# EasyEDA Pro project LCEDA_ProProject_2024-03-29.epro

# Schematic Schematic1
Create Date: 2024-03-13; Page Name: P1; Project Name: 为台式机设计的USB重力6D传感器; Schematic Name: Schematic1; Update Date: 2024-03-14; Company: Lzyor Studio; Page Size: A4; Version: V1.0
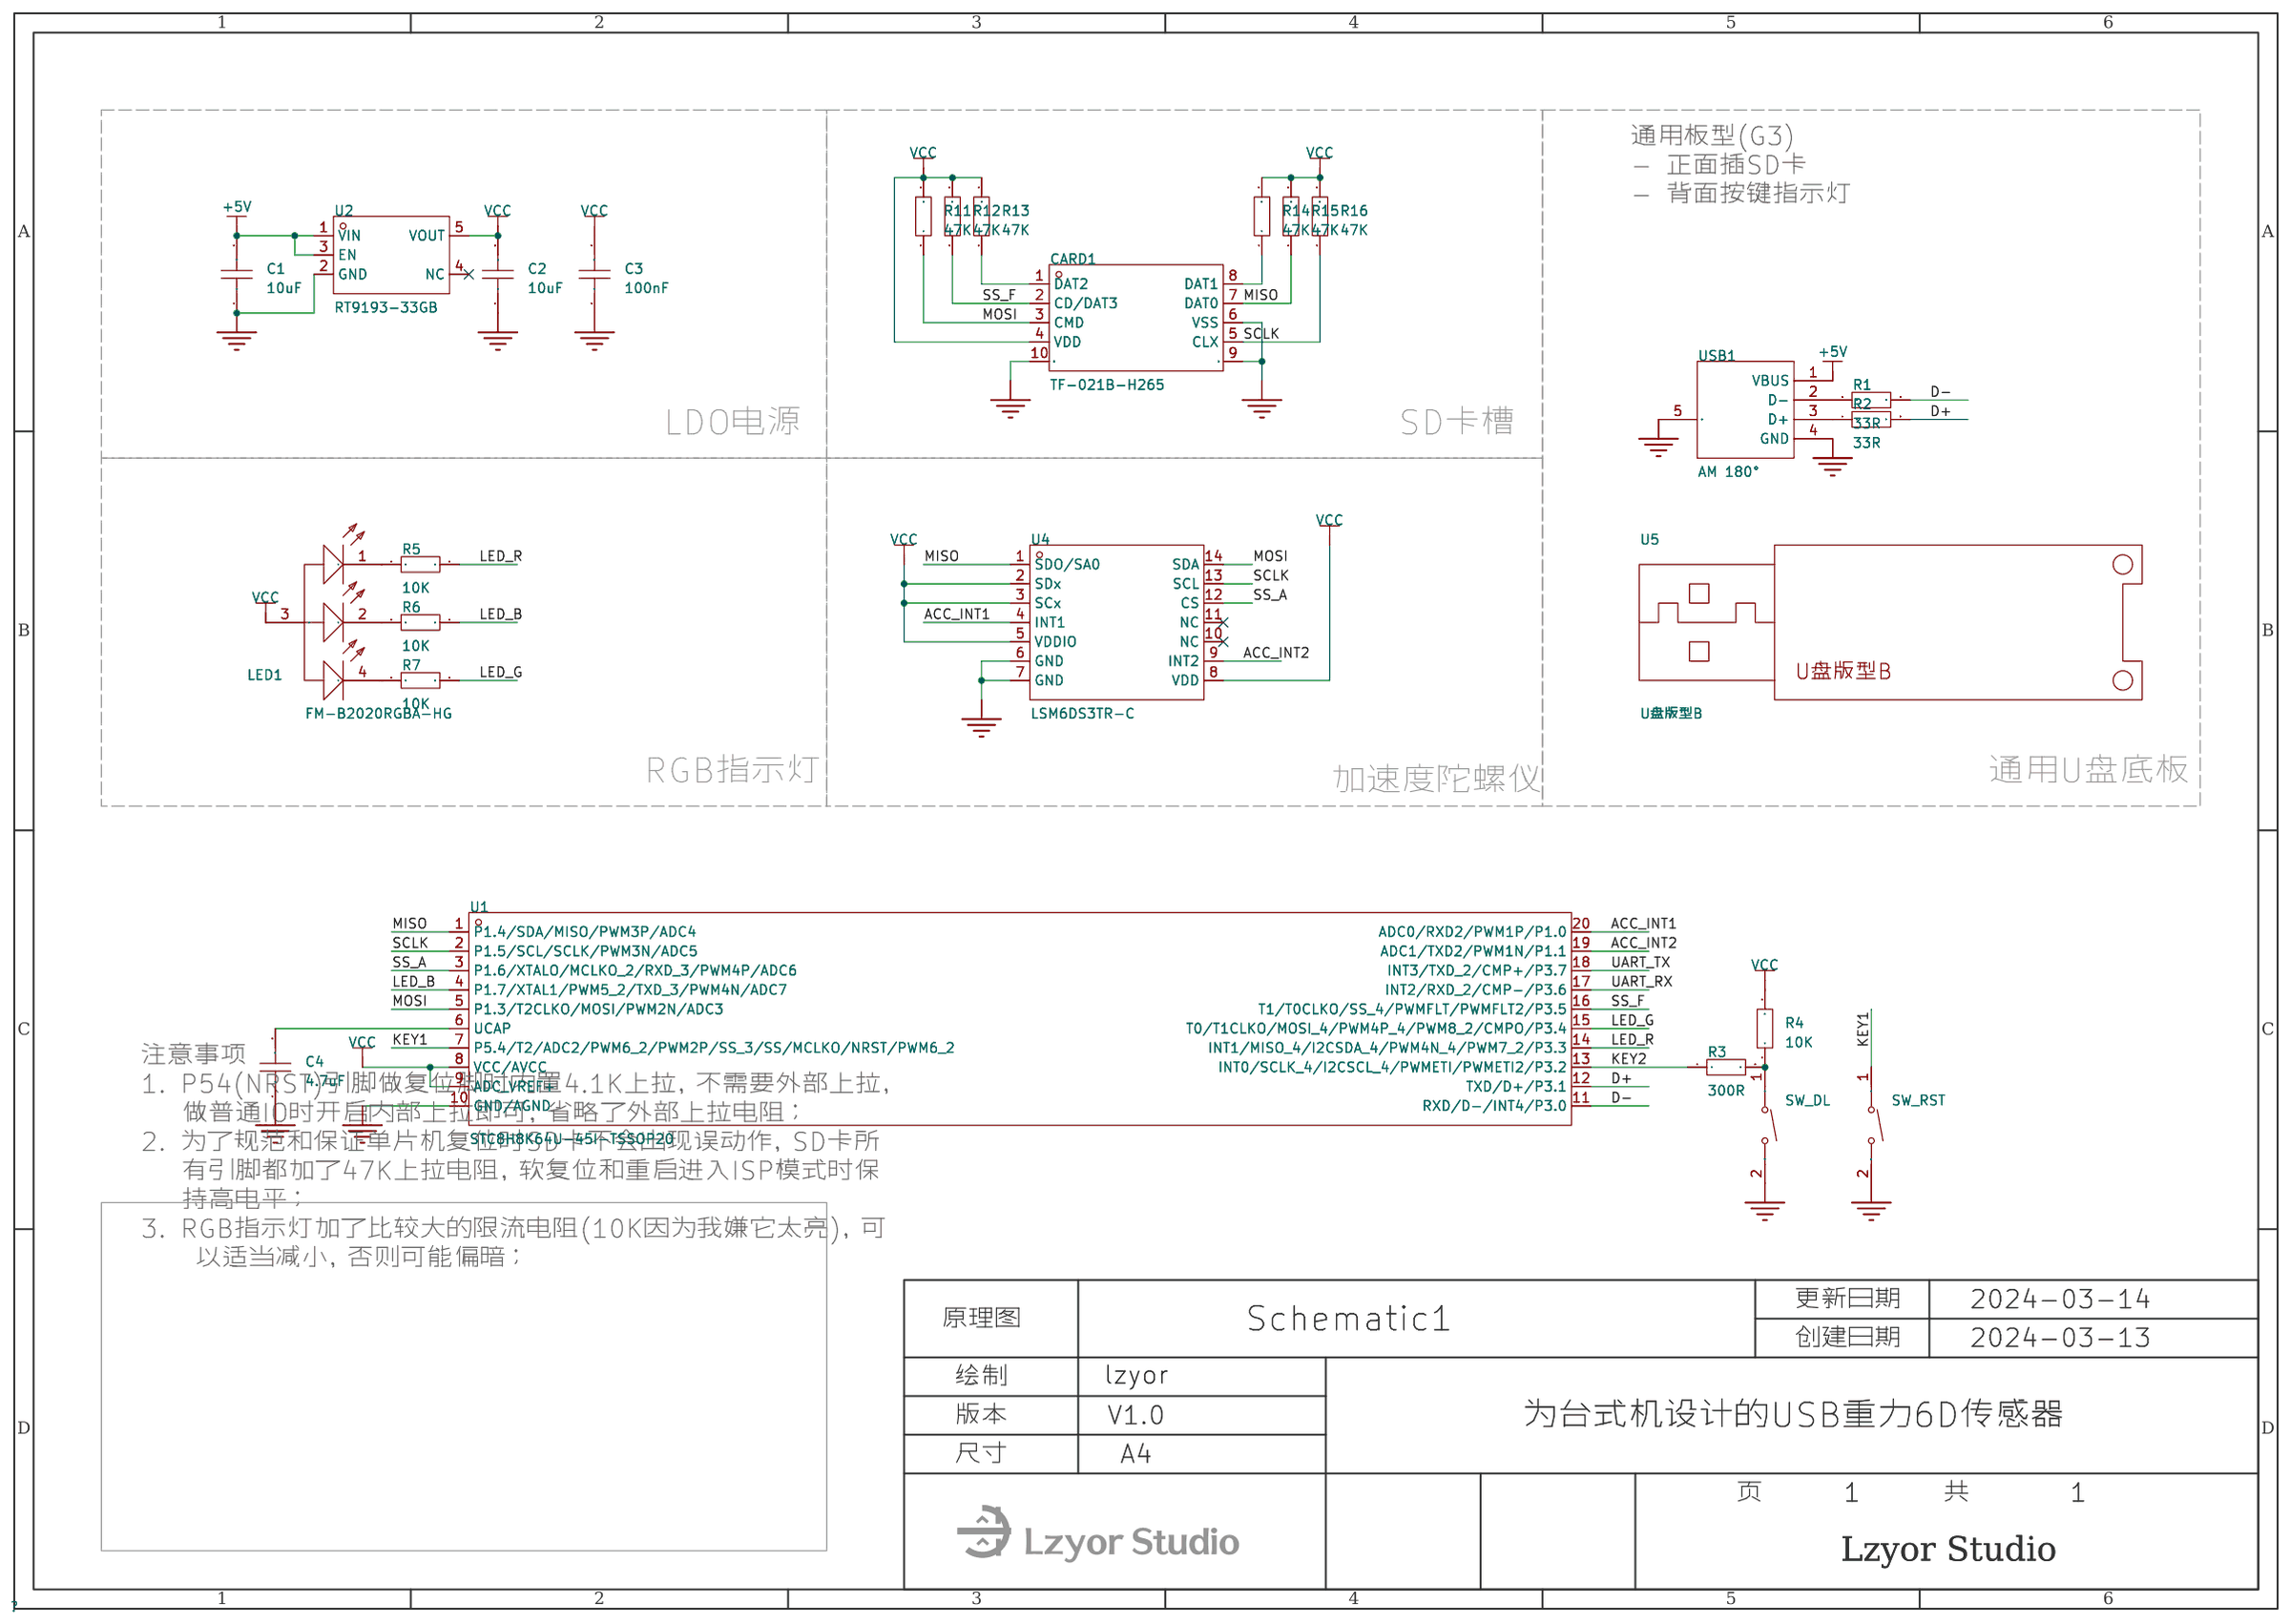
[diagram p0: schematic sheet]

## Parts
C1  10uF  [C0603]
C2  10uF  [C0603]
C3  100nF  [C0603]
C4  4.7uF  [C0603]
CARD1  TF-021B-H265  [TF-SMD_TF-021B-H265]
LED1  FM-B2020RGBA-HG  [LED-SMD_FM-B2020RGBA-HG]
R1  33R  [R0603]
R2  33R  [R0603]
R3  300R  [R0603]
R4  10K  [R0603]
R5  10K  [R0603]
R6  10K  [R0603]
R7  10K  [R0603]
R11  47K  [R0603]
R12  47K  [R0603]
R13  47K  [R0603]
R14  47K  [R0603]
R15  47K  [R0603]
R16  47K  [R0603]
SW_DL  GT-TS024B-H0060-L3  [KEY-SMD_L3.0-W2.0-LS3.5]
SW_RST  GT-TS024B-H0060-L3  [KEY-SMD_L3.0-W2.0-LS3.5]
U1  STC8H8K64U-45I-TSSOP20  [TSSOP-20_L6.5-W4.4-P0.65-LS6.5-BL]
U2  RT9193-33GB  [SOT-23-5_L3.0-W1.5-P0.95-LS2.8-BL]
U4  LSM6DS3TR-C  [LGA-14_L3.0-W2.5-P0.50-TL]
U5  U盘版型B  [U盘版型B]
USB1  AM 180°  [USB-SMD_AM180]

## Library data of the parts
C1-C4 = CAP_0603: Supplier Footprint: 0603
CARD1 = TF-021B-H265: 卡连接方式:拔插式;卡类型:MicroSD卡(TF卡);连接器类型:卡座;本体最大高度:2.5mm;工作温度范围:-25℃~+75℃;; LCSC Part Name: 拔插式 MicroSD卡(TF卡) 卡座; Supplier Part: C498185; Manufacturer: SOFNG(硕方); Supplier Footprint: SMD; JLCPCB Part Class: 扩展库; Datasheet: https://atta.szlcsc.com/upload/public/pdf/source/20200318/C498185_790264C8C4D0E25CCBD64FEBD13A33FF.pdf; Supplier: LCSC; Card Connection Mode: 拔插式; Card Type: MicroSD卡(TF卡); Connector Type: 卡座; Maximum Body Height: 2.5mm; Operating Temperature Range: -25℃~+75℃
LED1 = FM-B2020RGBA-HG: 发光颜色:RGB三色;正向电压(VF):2V；2.7V；2.8V;功率:64mW；48mW;正向电流:3mA;主波长:470nm；526nm；622nm;发光强度:150mcd；60mcd；22mcd;发光角度:110°;工作温度:-30℃~+85℃;; Supplier Part: C108793; Manufacturer: 国星光电; Supplier Footprint: SMD,2.1x2.1mm; JLCPCB Part Class: 扩展库; Datasheet: https://atta.szlcsc.com/upload/public/pdf/source/20180518/C108793_2518890ED811E900864AC79152D9E220.pdf; Supplier: LCSC; Emitted Color: RGB三色; Forward Voltage (VF): 2V；2.7V；2.8V; Power Dissipation: 64mW；48mW; Forward Current: 3mA; Dominant Wavelength: 470nm；526nm；622nm; Luminous Intensity: 150mcd；60mcd；22mcd; Viewing Angle: 110°; Operating Temperature: -30℃~+85℃
R1-R7 R11-R16 = Res_0603: Supplier Footprint: 0603
SW_DL SW_RST = GT-TS024B-H0060-L3: 电路结构:单刀单掷;按钮形状:圆形按钮;作用力:250gf;安装方式:立贴;开关长度:3mm;开关宽度:2mm;开关高度:0.6mm;带支架:不带;触点电流:50mA;额定电压(DC):12V;绝缘电阻:100MΩ;带灯:无;机械寿命:30万次;; LCSC Part Name: 3*2*0.6mm 立贴 轻触开关; Supplier Part: C2686961; Manufacturer: G-Switch(品赞); Supplier Footprint: SMD; JLCPCB Part Class: 扩展库; Datasheet: https://atta.szlcsc.com/upload/public/pdf/source/20210224/C2686961_B7A2156B901115225B7F5C73C5BECE5E.pdf; Supplier: LCSC; Circuit: 单刀单掷; Actuator Style: 圆形按钮; Operating Force: 250gf; Mounting Style: 立贴; Switch Length: 3mm; Switch Width: 2mm; Switch Height: 0.6mm; Strike Gundam: 不带; Contact Current: 50mA; Voltage Rating (DC): 12V; Insulation Resistance: 100MΩ; Actuator/Cap Color: 黑色; With Lamp: 无; Pin Style: SMD接片; Mechanical Life: 30万次; Operating Temperature: -30℃~+85℃
U1 = STC8H8K64U-45I-TSSOP20: LCSC Part Name: 宽电压/高速/高可靠/低功耗/强抗静电/较强抗干扰的新一代 8051 单片机; Supplier Part: C5210758; Manufacturer: STC(宏晶); Supplier Footprint: TSSOP-20; JLCPCB Part Class: 扩展库; Datasheet: https://atta.szlcsc.com/upload/public/pdf/source/20230914/FE7F6A67FEB4E2D9A560A799C5B97078.pdf; Supplier: LCSC
U2 = RT9193-33GB_C19268156: Supplier Part: C19268156; Manufacturer: TECH PUBLIC(台舟); Supplier Footprint: SOT-23-5; Datasheet: https://atta.szlcsc.com/upload/public/pdf/source/20231201/0E4AA64A86672323DAF7A55761D39120.pdf; Supplier: LCSC
U4 = LSM6DS3TR-C: 传感器类型:加速度计陀螺仪;; LCSC Part Name: IMU-惯性测量单元; Supplier Part: C967633; Manufacturer: ST(意法半导体); Supplier Footprint: LGA-14(2.5x3); JLCPCB Part Class: 扩展库; Datasheet: https://atta.szlcsc.com/upload/public/pdf/source/20210226/C967633_4D8B3A108D63359423D57B97CE5134B1.pdf; Supplier: LCSC; Sensor Type: 加速度计陀螺仪; Operating Temperature: -40℃~+85℃
U5 = U盘版型B: _: 3
USB1 = AM 180°: 连接器类型:Type-A;标准:USB 2.0;公母:公;端口数量:1;触点数量:4P;安装方式:卧贴;额定电流 - 电源:1A;工作温度范围:-40℃~+60℃;; LCSC Part Name: Type-A 公 卧贴; Supplier Part: C2681564; Manufacturer: SHOU HAN(首韩); Supplier Footprint: SMD; JLCPCB Part Class: 扩展库; Datasheet: https://atta.szlcsc.com/upload/public/pdf/source/20210107/C2681564_25DA62A2D5638CEDBC3A14F60B11E72F.pdf; Supplier: LCSC; Connector Type: Type-A; Standard: USB 2.0; Gender: 公; Number of Ports: 1; Number of Contacts: 4P; Mounting Style: 卧贴; Current Rating - Power (Max): 1A; Operating Temperature Range: -40℃~+60℃

## Nets
+5V: C1.2 U2.1(VIN) U2.3(EN) USB1.1(VBUS)
GND: C1.1 C2.1 C3.1 C4.1 CARD1.6(VSS) CARD1.9 CARD1.10 SW_DL.2 SW_RST.2 U1.10(GND/AGND) U2.2(GND) U4.6(GND) U4.7(GND) USB1.4(GND) USB1.5(EH)
VCC: C2.2 C3.2 CARD1.4(VDD) LED1.3(A) R4.2 R11.2 R12.2 R13.2 R14.2 R15.2 R16.2 U1.8(VCC/AVCC) U1.9(ADC_VREF+) U2.5(VOUT) U4.2(SDx) U4.3(SCx) U4.5(VDDIO) U4.8(VDD)
ACC_INT1: U1.20(ADC0/RXD2/PWM1P/P1.0) U4.4(INT1)
ACC_INT2: U1.19(ADC1/TXD2/PWM1N/P1.1) U4.9(INT2)
D+: R2.2 U1.12(TXD/D+/P3.1)
D-: R1.2 U1.11(RXD/D-/INT4/P3.0)
KEY1: SW_RST.1 U1.7(P5.4/T2/ADC2/PWM6_2/PWM2P/SS_3/SS/MCLKO/NRST/PWM6_2)
KEY2: R3.1 U1.13(INT0/SCLK_4/I2CSCL_4/PWMETI/PWMETI2/P3.2)
LED_B: R6.1 U1.4(P1.7/XTAL1/PWM5_2/TXD_3/PWM4N/ADC7)
LED_G: R7.1 U1.15(T0/T1CLKO/MOSI_4/PWM4P_4/PWM8_2/CMPO/P3.4)
LED_R: R5.1 U1.14(INT1/MISO_4/I2CSDA_4/PWM4N_4/PWM7_2/P3.3)
MISO: CARD1.7(DAT0) R15.1 U1.1(P1.4/SDA/MISO/PWM3P/ADC4) U4.1(SDO/SA0)
MOSI: CARD1.3(CMD) R11.1 U1.5(P1.3/T2CLKO/MOSI/PWM2N/ADC3) U4.14(SDA)
SCLK: CARD1.5(CLX) R16.1 U1.2(P1.5/SCL/SCLK/PWM3N/ADC5) U4.13(SCL)
SS_A: U1.3(P1.6/XTALO/MCLKO_2/RXD_3/PWM4P/ADC6) U4.12(CS)
SS_F: CARD1.2(CD/DAT3) R12.1 U1.16(T1/T0CLKO/SS_4/PWMFLT/PWMFLT2/P3.5)
UART_RX: U1.17(INT2/RXD_2/CMP-/P3.6)
UART_TX: U1.18(INT3/TXD_2/CMP+/P3.7)
$1N887: C4.2 U1.6(UCAP)
$1N902: R1.1 USB1.2(D-)
$1N909: R2.1 USB1.3(D+)
$1N950: LED1.1(K) R5.2
$1N951: LED1.2(K) R6.2
$1N952: LED1.4(K) R7.2
$1N4102: CARD1.8(DAT1) R14.1
$1N4105: CARD1.1(DAT2) R13.1
Net-(R3-2): R3.2 R4.1 SW_DL.1

Not connected (* = marked no-connect by the designer): U2 4(NC)*; U4 10(NC)* 11(NC)*

## Notes on the sheet
- 通用板型(G3)
  - 正面插SD卡
  - 背面按键指示灯
- LDO电源
- SD卡槽
- RGB指示灯
- 加速度陀螺仪
- 通用U盘底板
- 注意事项
  1. P54(NRST)引脚做复位脚时内置4.1K上拉，不需要外部上拉，
     做普通IO时开启内部上拉即可，省略了外部上拉电阻；
  2. 为了规范和保证单片机复位时SD卡不会出现误动作，SD卡所
     有引脚都加了47K上拉电阻，软复位和重启进入ISP模式时保
     持高电平；
  3. RGB指示灯加了比较大的限流电阻(10K因为我嫌它太亮)，可
      以适当减小，否则可能偏暗；
- lzyor

# Board PCB1
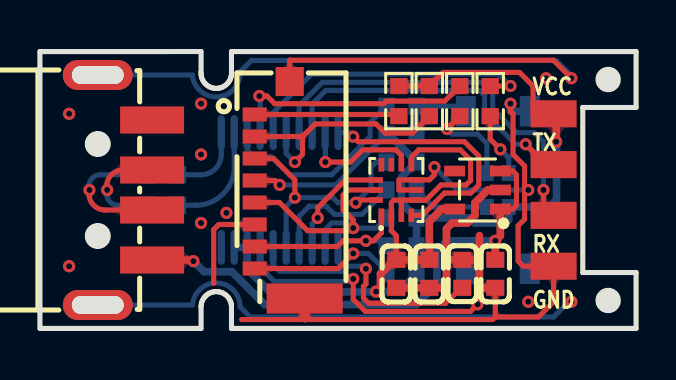
[diagram p1: board, top side]
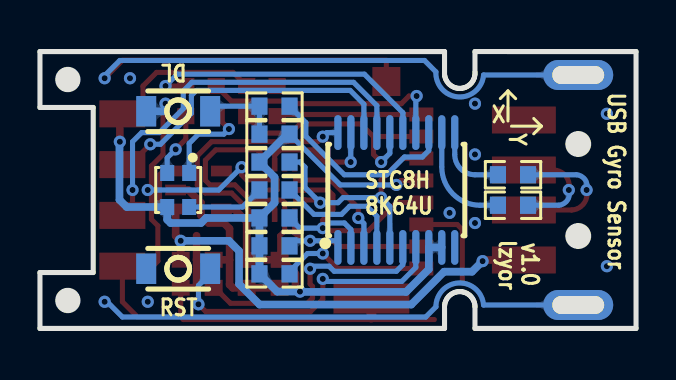
[diagram p2: board, bottom side, seen from below]

Outline 29.85 x 13.84 mm; copper layers: Top Layer, Bottom Layer. Coordinates in mm from the lower left corner of the outline.
Stack: Top Layer 0.035mm / Dielectric1 1.51mm FR4 er 4.5 / Bottom Layer 0.035mm

## Design rules (mm)
template: 自定义配置
spacing copperThickness1oz (default): track to track 0.152, other pairs 0.152 to 0.305
spacing copperThickness2oz: track to track 0.203, other pairs 0.152 to 0.3
track width copperThickness1oz (default): min 0.127, default 0.254, max 2.54
track width copperThickness2oz: min 0.203, default 0.254, max 2.54
differential pair differentialPair (default): width min 0.127, default 0.254, max 2.54; gap min 0.152, default 0.152
via viaSize (default): diameter min 0.5, default 0.61, max 10; hole min 0.3, default 0.305, max 6.299
pour e969 uses copperRegion
pour e913 uses copperRegion

## Placement (name value [footprint] x y rotation side)
C1  10uF  [C0603]  22.8 2.73 90 top
C2  10uF  [C0603]  17.84 2.73 90 top
C3  100nF  [C0603]  19.49 2.73 90 top
C4  4.7uF  [C0603]  21.15 2.73 270 top
CARD1  TF-021B-H265  [TF-SMD_TF-021B-H265]  12 6.92 90 top
LED1  FM-B2020RGBA-HG  [LED-SMD_FM-B2020RGBA-HG]  22.92 6.92 270 bottom
NOREF  -  [Pad_e33]  25.72 3.11 90 top
NOREF#2  -  [Pad_e31]  25.72 8.19 90 top
NOREF#3  -  [Pad_e30]  25.72 10.73 90 top
NOREF#4  -  [Pad_e32]  25.72 5.65 90 top
R1  33R  [R0603]  6.16 7.68 0 bottom
R2  33R  [R0603]  6.16 6.16 0 bottom
R3  300R  [R0603]  18.1 11.11 0 bottom
R4  10K  [R0603]  18.1 9.72 180 bottom
R5  10K  [R0603]  21.02 11.37 270 top
R6  10K  [R0603]  18.1 6.92 0 bottom
R7  10K  [R0603]  22.54 11.37 270 top
R11  47K  [R0603]  18.1 8.32 0 bottom
R12  47K  [R0603]  19.49 11.37 90 top
R13  47K  [R0603]  17.97 11.37 90 top
R14  47K  [R0603]  18.1 2.73 0 bottom
R15  47K  [R0603]  18.1 4.13 0 bottom
R16  47K  [R0603]  18.1 5.52 0 bottom
SW1  GT-TS024B-H0060-L3  [KEY-SMD_L3.0-W2.0-LS3.5]  22.92 10.86 0 bottom
SW2  GT-TS024B-H0060-L3  [KEY-SMD_L3.0-W2.0-LS3.5]  22.92 2.98 0 bottom
U1  STC8H8K64U-45I-TSSOP20  [TSSOP-20_L6.5-W4.4-P0.65-LS6.5-BL]  12 6.92 180 bottom
U2  RT9193-33GB  [SOT-23-5_L3.0-W1.5-P0.95-LS2.8-BL]  21.91 6.92 90 top
U4  LSM6DS3TR-C  [LGA-14_L3.0-W2.5-P0.50-TL]  17.84 6.92 90 top
U5  -  [U盘版型B]  14.92 6.92 0 top
USB1  AM 180°  [USB-SMD_AM180]  4.25 6.92 270 top

## Footprints (pads in the part's own frame, mm; a bottom-side part is the same pattern mirrored in y, then rotated)
C0603
  rect 0.8x0.9 smd: 1(-0.7,0) 2(0.7,0)
KEY-SMD_L3.0-W2.0-LS3.5
  rect 1x1.524 smd: 1(-1.6,0) 2(1.6,0)
LED-SMD_FM-B2020RGBA-HG
  rect 0.8x0.7 smd: 1(-0.85,0.55) 2(0.85,0.55) 3(0.85,-0.55) 4(-0.85,-0.55)
LGA-14_L3.0-W2.5-P0.50-TL
  rect 0.675x0.28 smd: 1(-1.262,0.75) 2(-1.262,0.25) 3(-1.262,-0.25) 4(-1.262,-0.75) 8(1.262,-0.75) 9(1.262,-0.25) 10(1.262,0.25) 11(1.262,0.75)
  rect 0.28x0.675 smd: 5(-0.5,-1.012) 6(0,-1.012) 7(0.5,-1.012) 12(0.5,1.012) 13(0,1.012) 14(-0.5,1.012)
Pad_e30
  rect 1.35x2.3 smd: 10(0,0)
Pad_e31
  rect 1.35x2.3 smd: 12(0,0)
Pad_e32
  rect 1.35x2.3 smd: 11(0,0)
Pad_e33
  rect 1.35x2.3 smd: 13(0,0)
R0603
  rect 0.806x0.864 smd: 1(-0.753,0) 2(0.753,0)
SOT-23-5_L3.0-W1.5-P0.95-LS2.8-BL
  rect 0.532x1.045 smd: 1(-0.95,-1.147) 2(0,-1.147) 3(0.95,-1.147) 4(0.95,1.147) 5(-0.95,1.147)
TF-SMD_TF-021B-H265
  rect 0.7x1.2 smd: 1(3.775,1.25) 2(2.675,1.25) 3(1.575,1.25) 4(0.475,1.25) 5(-0.625,1.25) 6(-1.725,1.25) 7(-2.825,1.25) 8(-3.925,1.25)
  rect 1.5x3.8 smd: 9(-5.425,-1.25)
  rect 1.45x1.4 smd: 10(5.425,-0.5)
TSSOP-20_L6.5-W4.4-P0.65-LS6.5-BL
  oval 0.364x1.742 smd: 1(-2.925,-2.871) 2(-2.275,-2.871) 3(-1.625,-2.871) 4(-0.975,-2.871) 5(-0.325,-2.871) 6(0.325,-2.871) 7(0.975,-2.871) 8(1.625,-2.871) 9(2.275,-2.871) 10(2.925,-2.871) 11(2.925,2.871) 12(2.275,2.871) 13(1.625,2.871) 14(0.975,2.871) 15(0.325,2.871) 16(-0.325,2.871) 17(-0.975,2.871) 18(-1.625,2.871) 19(-2.275,2.871) 20(-2.925,2.871)
USB-SMD_AM180
  rect 1.35x3.2 smd: 1(3.5,1.36) 2(1,1.36) 3(-1,1.36) 4(-3.5,1.36)
  oval 1.5x3.5 hole 0.9x2.6: 5(-5.75,-1.36) 5(5.75,-1.36)

## Nets
+5V: C1.2 U2.1 U2.3 USB1.1
GND: C1.1 C2.1 C3.1 C4.1 CARD1.6 CARD1.9 CARD1.10 NOREF.13 SW1.2 SW2.2 U1.10 U2.2 U4.6 U4.7 USB1.4 USB1.5
VCC: C2.2 C3.2 CARD1.4 LED1.3 NOREF#3.10 R4.2 R11.2 R12.2 R13.2 R14.2 R15.2 R16.2 U1.8 U1.9 U2.5 U4.2 U4.3 U4.5 U4.8
ACC_INT1: U1.20 U4.4
ACC_INT2: U1.19 U4.9
D+: R2.2 U1.12
D-: R1.2 U1.11
KEY1: SW2.1 U1.7
KEY2: R3.1 U1.13
LED_B: R6.1 U1.4
LED_G: R7.1 U1.15
LED_R: R5.1 U1.14
MISO: CARD1.7 R15.1 U1.1 U4.1
MOSI: CARD1.3 R11.1 U1.5 U4.14
SCLK: CARD1.5 R16.1 U1.2 U4.13
SS_A: U1.3 U4.12
SS_F: CARD1.2 R12.1 U1.16
UART_RX: NOREF#4.11 U1.17
UART_TX: NOREF#2.12 U1.18
$1N887: C4.2 U1.6
$1N902: R1.1 USB1.2
$1N903: R3.2 R4.1 SW1.1
$1N909: R2.1 USB1.3
$1N950: LED1.1 R5.2
$1N951: LED1.2 R6.2
$1N952: LED1.4 R7.2
$1N4102: CARD1.8 R14.1
$1N4105: CARD1.1 R13.1

Pads without a net: U2 4; U4 10 11

## Via types
v1: diameter 0.61, hole 0.305, Top Layer to Bottom Layer, 38 vias

## Routing (per net, layer and track width the routed paths; a pad name or vN(x,y) marks a point on that pad's centre or on a via; arc(x,y) is an arc through that point)
+5V: length 26.1
  Top Layer w0.254: U2.1 23.05,5.97 23.66,5.97 23.86,6.16 23.86,7.68 23.67,7.87 U2.3
  Top Layer w0.381: 22.8,3.62 v1(22.8,4.38) 23.05,4.64 23.05,5.97 ; v1(7.68,3.37) 7.63,3.42 USB1.1
  Bottom Layer w0.381: v1(22.8,4.38) 20.38,4.38 19.88,3.87 19.88,2.22 18.85,1.19 11.25,1.19 9.61,2.84 8.21,2.84 v1(7.68,3.37)
GND: length 126.3
  Top Layer w0.254: v1(19.75,8.06) 19.75,7.68 19.49,7.43 18.85,7.43 ; 22.8,0.57 24.96,0.57 25.72,1.33 NOREF.13 24.19,3.11 23.94,3.37 23.94,5.13 24.26,5.46 24.26,8.12 23.69,8.7 23.69,10.73 23.56,10.86 v1(23.56,11.24) ; 22.8,0.57 22.67,0.44 10.1,0.44 ; 22.8,0.57 22.8,1.91 ; CARD1.6 8.95,5.2 8.7,4.94 8.7,2.27 arc(8.7,2.27) 8.69,2.27 ; 18.85,7.43 U4.7 ; 18.85,7.43 17.97,7.43 17.97,6.92 U4.6 ; v1(26.61,12.51) 25.71,13.41 12.5,13.41 CARD1.10
  Top Layer w0.381: 20.35,3.42 20.35,2.19 20.19,2.03 C3.1 C2.1 ; 20.35,3.42 20.35,4.99 20.64,5.27 21.4,5.27 21.78,5.65 21.78,6.29 22.42,6.92 U2.2 ; 20.35,3.42 20.36,3.43 C4.1 22,3.43 ; 22,3.43 22,2.13 22.1,2.03 C1.1 ; 22,3.43 22,4.64
  Top Layer w0.508: CARD1.9 13.25,0.56 13.27,0.56
  Bottom Layer w0.254: v1(24.45,6.92) 20.89,6.92 v1(19.75,8.06) ; v1(26.61,1.33) 26.48,1.33 25.72,0.57 10.53,0.57 10.02,1.08 arc(8.87,2.27) 7.64,1.17 USB1.5 ; USB1.5 7.63,12.67 arc(8.9,11.57) 10.02,12.83 10.59,13.4 25.84,13.4 26.61,12.64 v1(26.61,12.51)
  Bottom Layer w0.381: SW1.2 23.56,10.86 v1(23.56,11.24)
  vias: v1(1.46,10.73) v1(1.46,3.11) v1(8.06,11.24) v1(8.06,8.7) v1(8.06,5.27) v1(9.33,5.78) v1(24.45,1.33) v1(25.34,12.51)
VCC: length 69.2
  Top Layer w0.254: 18.85,6.41 19.32,6.41 20.08,7.18 21.33,7.18 21.56,7.4 21.56,8.41 21.04,8.93 18.96,8.93 18.61,8.57 18.61,8.2 U4.8 ; 18.85,6.41 U4.5 ; 18.85,6.41 18.1,6.41 ; v1(12,7.18) 11.78,7.4 CARD1.4 ; 18.1,6.41 17.72,6.41 17.59,6.29 U4.2 17.59,5.66 17.59,4.89 17.84,4.64 C2.2 ; 18.1,6.41 18.1,5.66 U4.3 ; R13.2 R12.2 20.18,12.8 24.01,12.8 24.69,12.12 24.69,10.75 24.7,10.73 NOREF#3.10
  Top Layer w0.381: v1(16.83,1.84) 17.05,2.06 17.05,2.73 17.75,3.43 C2.2 C3.2 19.49,5.35 20.12,5.97 U2.5 ; NOREF#3.10 25.84,10.6 v1(25.84,9.33)
  Bottom Layer w0.254: R4.2 14.81,7.18 v1(12,7.18)
  Bottom Layer w0.381: 18.86,5.52 21.53,5.52 21.78,5.27 23.31,5.27 23.47,5.44 LED1.3 25.5,6.07 25.86,6.43 25.86,9.32 v1(25.84,9.33) ; 18.86,5.52 18.1,6.28 18.1,7.56 18.86,8.32 17.46,9.72 R4.2 ; 18.86,5.52 18.86,2.73 17.97,1.84 v1(16.83,1.84) 16.82,1.83 11.51,1.83 10.38,2.96 U1.8 U1.9
ACC_INT1: length 13
  Top Layer w0.254: v1(15.68,9.59) 15.94,9.33 21.25,9.33 21.97,8.62 21.97,7.17 21.57,6.77 20.25,6.77 19.14,5.66 U4.4
  Bottom Layer w0.254: v1(15.68,9.59) 15.48,9.79 U1.20
ACC_INT2: length 6.1
  Top Layer w0.254: U4.9 18.09,8.65 17.81,8.93 16.17,8.93 15.56,8.32 v1(14.29,8.32)
  Bottom Layer w0.254: v1(14.29,8.32) 14.29,9.78 U1.19
D+: length 5.6
  Bottom Layer w0.254: U1.12 9.73,8.08 arc(9.17,6.72) 7.81,6.16 R2.2
D-: length 3.8
  Bottom Layer w0.254: U1.11 9.08,8.7 arc(8.78,7.98) 8.06,7.68 R1.2
KEY1: length 15.4
  Top Layer w0.254: v1(15.68,2.48) 15.68,1.46 16.29,0.85 21.55,0.85 v1(21.91,1.21)
  Bottom Layer w0.254: v1(15.68,2.48) 15.56,2.35 11.73,2.35 11.03,3.05 U1.7 ; v1(21.91,1.21) 21.91,2.15 21.32,2.73
KEY2: length 10.2
  Bottom Layer w0.254: U1.13 10.38,8.9 10.7,8.57 11.6,8.57 12.49,7.68 14.61,7.68 16.53,9.61 16.53,10.3 R3.1
LED_B: length 6.8
  Bottom Layer w0.254: 17.34,6.92 16.13,5.7 14.74,5.7 14.34,6.11 13.47,6.11 12.98,5.61 U1.4
LED_G: length 14.9
  Top Layer w0.254: R7.1 v1(23.56,12.12)
  Bottom Layer w0.254: v1(23.56,12.12) 22.97,12.71 13.6,12.71 11.68,10.79 U1.15
LED_R: length 12.4
  Top Layer w0.254: R5.1 20.27,11.37 17.34,11.37 17.21,11.24 11.75,11.24 11.37,11.62 v1(10.99,11.62)
  Bottom Layer w0.254: U1.14 11.03,11.58 v1(10.99,11.62)
MISO: length 10.4
  Top Layer w0.254: CARD1.7 14.89,4.1 15.18,4.38 v1(16.32,4.38) 16.7,4.38 17.09,4.77 U4.1
  Bottom Layer w0.254: R15.1 17.09,4.38 v1(16.32,4.38) 14.93,4.38 U1.1
MOSI: length 13.2
  Top Layer w0.254: CARD1.3 11.7,8.5 12.76,7.43 v1(12.76,6.54) ; v1(15.81,6.29) 15.95,6.42 U4.14
  Bottom Layer w0.254: R11.1 16.83,8.32 16.57,8.06 16.57,7.05 v1(15.81,6.29) 14.92,6.29 14.67,6.54 v1(12.76,6.54) 12.33,6.1 U1.5
SCLK: length 13.6
  Top Layer w0.254: CARD1.5 11.99,6.3 13.4,4.89 15.78,4.89 ; v1(15.68,5.02) 15.68,5.42 15.18,5.93 15.18,6.67 15.43,6.92 U4.13
  Bottom Layer w0.254: U1.2 14.28,4.95 14.6,5.27 15.43,5.27 v1(15.68,5.02) 16.84,5.02 R16.1
SS_A: length 5.6
  Top Layer w0.254: U4.12 15.3,7.42 13.91,6.03 v1(13.91,5.52)
  Bottom Layer w0.254: v1(13.91,5.52) 13.63,5.24 U1.3
SS_F: length 12.6
  Top Layer w0.254: R12.1 18.65,9.77 17.28,9.77 16.83,10.22 13.78,10.22 13.15,9.6 13.14,9.6 ; 13.14,9.6 13.14,9.59 13.14,8.7 v1(12.76,8.32) ; 13.14,9.6 CARD1.2
  Bottom Layer w0.254: v1(12.76,8.32) 12.33,8.76 U1.16
UART_RX: length 20
  Top Layer w0.254: NOREF#4.11 25.21,5.65 v1(25.21,6.92)
  Bottom Layer w0.254: U1.17 12.98,11.14 14.14,12.31 22.24,12.31 22.67,11.87 22.67,10.99 23.86,9.79 24.75,9.79 25.21,9.33 v1(25.21,6.92)
UART_TX: length 15.9
  Top Layer w0.254: NOREF#2.12 25.34,8.19 v1(24.32,9.21)
  Bottom Layer w0.254: U1.18 13.63,11.21 14.31,11.9 22.01,11.9 22.26,11.65 22.26,10.76 23.81,9.21 v1(24.32,9.21)
$1N887: length 12.6
  Top Layer w0.254: v1(16.32,2.98) 16.32,2.22 16.2,2.1 16.2,1.52 16.46,1.26 20.31,1.26 20.95,1.9 21.15,1.9
  Bottom Layer w0.254: v1(16.32,2.98) 16.19,3.11 15.37,3.11 15.11,2.86 12,2.86 11.68,3.18 U1.6
$1N902: length 7.3
  Top Layer w0.254: USB1.2 3.22,5.92 arc(2.61,6.25) v1(2.48,6.92)
  Bottom Layer w0.254: R1.1 2.98,7.68 arc(2.54,7.43) v1(2.48,6.92)
$1N903: length 4
  Bottom Layer w0.254: 18.86,9.72 18.86,11.11 21.07,11.11 SW1.1
$1N909: length 5.5
  Top Layer w0.254: USB1.3 4.11,7.92 arc(3.5,7.6) v1(3.37,6.92)
  Bottom Layer w0.254: R2.1 3.87,6.16 arc(3.43,6.42) v1(3.37,6.92)
$1N950: length 4.7
  Top Layer w0.254: v1(20.38,9.97) 21.02,10.6 R5.2
  Bottom Layer w0.254: v1(20.38,9.97) 20.64,9.72 21.91,9.72 22.37,9.25 LED1.1
$1N951: length 3.9
  Bottom Layer w0.254: LED1.2 19.71,6.07 18.86,6.92
$1N952: length 3.2
  Top Layer w0.254: v1(23.05,8.95) 22.54,9.46 R7.2
  Bottom Layer w0.254: LED1.4 23.47,8.53 v1(23.05,8.95)
$1N4102: length 7.4
  Top Layer w0.254: v1(15.68,3.75) 14.93,3 CARD1.8
  Bottom Layer w0.254: R14.1 17.35,2.84 16.45,3.75 v1(15.68,3.75)
$1N4105: length 7.3
  Top Layer w0.254: R13.1 17.89,10.7 CARD1.1

## Copper pours and planes (outline as drawn; the poured copper is in the pictures)
GND on Top Layer: -1.84,15.56 30.16,15.56 30.16,-0.44 -1.84,-0.44
GND on Bottom Layer: -0.7,14.41 31.81,14.41 31.81,-1.97 -0.7,-1.97

Small or netless copper shapes (teardrops, artwork), in the pictures only: 73 on Top Layer, 66 on Bottom Layer

## Text on the board
Bottom Silkscreen Layer: DL | RST | USB Gyro Sensor | v1.0 | lzyor | X | STC8H / 8K64U | Y
Document Layer: lzyor | GND | 3.3V | TX | RX | v1.0 2024-03-14
Top Silkscreen Layer: VCC | RX | GND | TX
